# Altium schematic sheet 电机控制器原理图.SchDoc
size A3
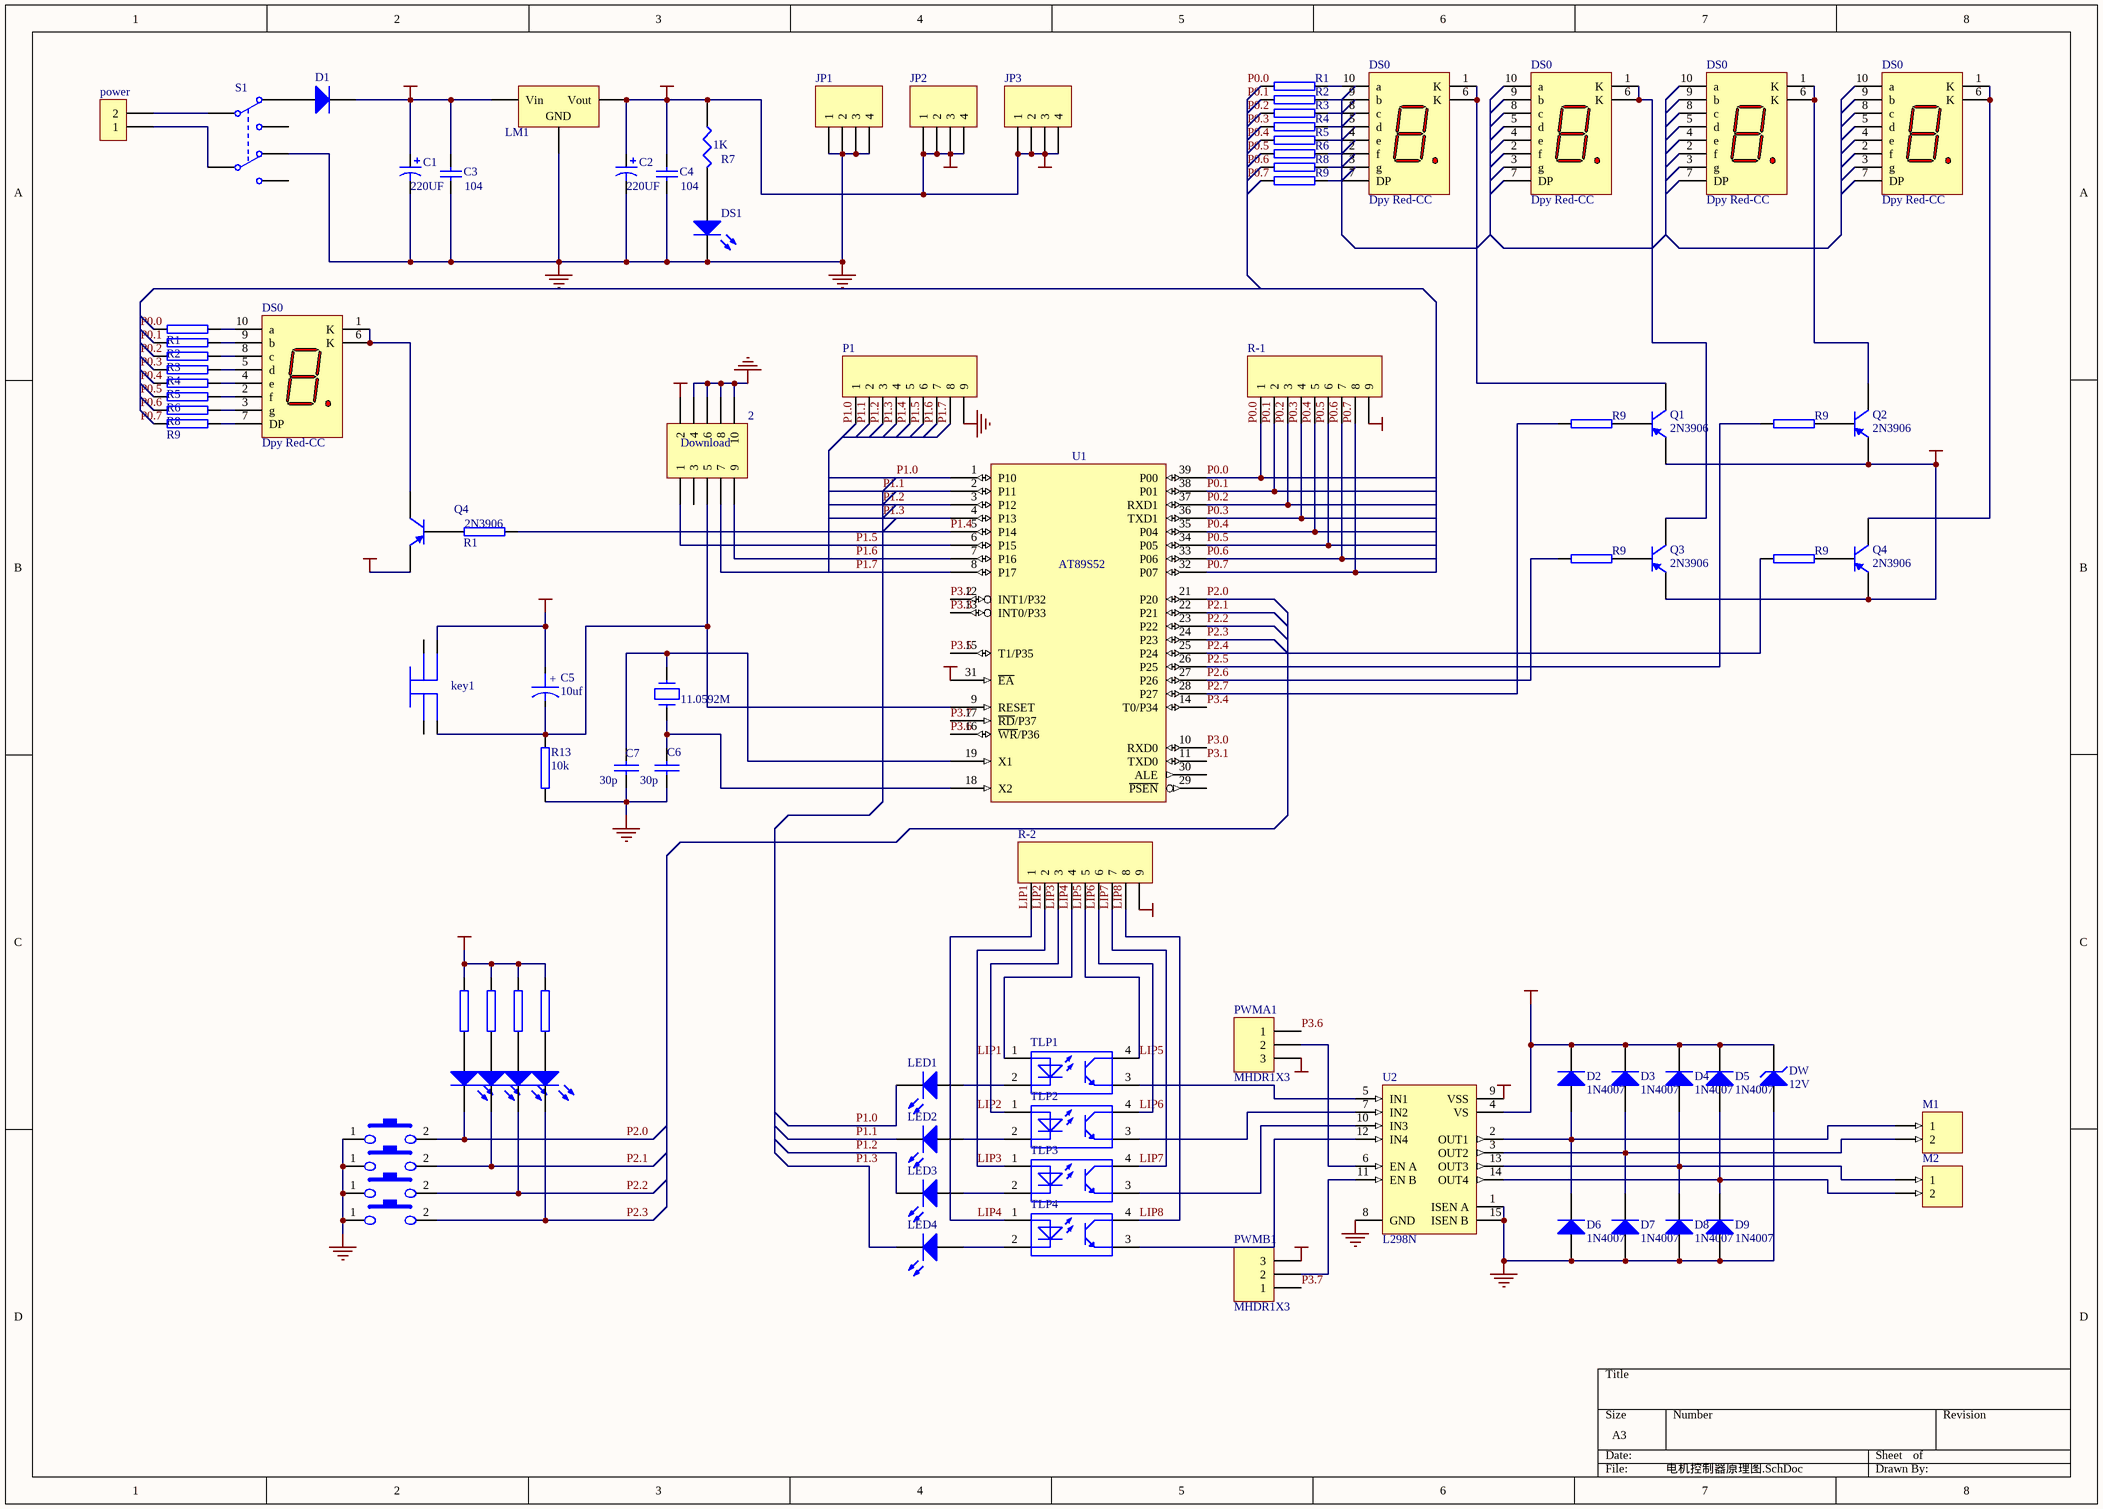
[diagram p0: 电机控制器原理图.SchDoc]

## Parts
(Parts that share a designator on the sheet are numbered #1, #2 ... from top to bottom, then left to right.)
1  power  [DZ-2]
2  Download  [HDR2X5]
3  key1  [AN66]  (value not drawn)
4  key2  [AN66]  (value not drawn)
5  key3  [AN66]  (value not drawn)
7  key4  [AN66]  (value not drawn)
C1  value 220UF  [CD6]
C2  value 220UF  [CD4]
C3  value 104  [HDR1X2]
C4  value 104  [HDR1X2]
C5  10uf  [CD5]
C6  30p  [C1608-0603]
C7  30p  [C1608-0603]
D1  (no value)  [DIO10.46-5.3x2.8]
D2  1N4007  [DIO7.8-4.6x2]
D3  1N4007  [DIO7.8-4.6x2]
D4  1N4007  [DIO7.8-4.6x2]
D5  1N4007  [DIO7.8-4.6x2]
D6  1N4007  [DIO7.8-4.6x2]
D7  1N4007  [DIO7.8-4.6x2]
D8  1N4007  [DIO7.8-4.6x2]
D9  1N4007  [DIO7.8-4.6x2]
DS0#1  Dpy Red-CC  [LEDDIP-10/C5.08RHD]
DS0#2  Dpy Red-CC  [LEDDIP-10/C5.08RHD]
DS0#3  Dpy Red-CC  [LEDDIP-10/C5.08RHD]
DS0#4  Dpy Red-CC  [LEDDIP-10/C5.08RHD]
DS0#5  Dpy Red-CC  [LEDDIP-10/C5.08RHD]
DS1  (no value)  [HDR1X2]
DW  12V  [DIODE-0.7]
JP1  (no value)  [HDR1X4]
JP2  (no value)  [HDR1X4]
JP3  (no value)  [HDR1X4]
key1  KEY  [AN66]  (value not drawn)
LED1  (no value)  [HDR1X2]
LED2  (no value)  [HDR1X2]
LED3  (no value)  [HDR1X2]
LED4  (no value)  [HDR1X2]
LED5  (no value)  [HDR1X2]
led6  (no value)  [HDR1X2]
LED7  (no value)  [HDR1X2]
LED8  (no value)  [HDR1X2]
LM1  (no value)  [wyk]
M1  (no value)  [DZ-2]
M2  (no value)  [DZ-2]
P1  (no value)  [HDR1X9]
PWMA1  MHDR1X3  [MHDR1X3]
PWMB1  MHDR1X3  [MHDR1X3]
Q1  2N3906  [BCY-W3/E4]
Q2  2N3906  [BCY-W3/E4]
Q3  2N3906  [BCY-W3/E4]
Q4#1  2N3906  [BCY-W3/E4]
Q4#2  2N3906  [BCY-W3/E4]
R1#1  470  [INDC2012-0805]  (value not drawn)
R1#2  470  [INDC2012-0805]  (value not drawn)
R1#3  470  [INDC2012-0805]  (value not drawn)
R2#1  470  [INDC2012-0805]  (value not drawn)
R2#2  470  [INDC2012-0805]  (value not drawn)
R3#1  470  [INDC2012-0805]  (value not drawn)
R3#2  470  [INDC2012-0805]  (value not drawn)
R4#1  470  [INDC2012-0805]  (value not drawn)
R4#2  470  [INDC2012-0805]  (value not drawn)
R5#1  470  [INDC2012-0805]  (value not drawn)
R5#2  470  [INDC2012-0805]  (value not drawn)
R6#1  470  [INDC2012-0805]  (value not drawn)
R6#2  470  [INDC2012-0805]  (value not drawn)
R7  1K  [HDR1X2]
R8#1  470  [INDC2012-0805]  (value not drawn)
R8#2  470  [INDC2012-0805]  (value not drawn)
R9#1  470  [INDC2012-0805]  (value not drawn)
R9#2  470  [INDC2012-0805]  (value not drawn)
R9#3  470  [INDC2012-0805]  (value not drawn)
R9#4  470  [INDC2012-0805]  (value not drawn)
R9#5  470  [INDC2012-0805]  (value not drawn)
R9#6  470  [INDC2012-0805]  (value not drawn)
R13  10k  [INDC2012-0805]
R15  470  [INDC2012-0805]  (value not drawn)
R16  470  [INDC2012-0805]  (value not drawn)
R17  470  [INDC2012-0805]  (value not drawn)
R18  470  [INDC2012-0805]  (value not drawn)
R-1  (no value)  [HDR1X9]
R-2  (no value)  [HDR1X9]
S1  (no value)  [DPDT-6]
TLP1  (no value)  [DIP4]
TLP2  (no value)  [DIP4]
TLP3  (no value)  [DIP4]
TLP4  (no value)  [DIP4]
U1  AT89S52  [DIP40]
U2  L298N  [DFM-T15/X1.6V]
Y1  11.0592M  [SPST-2]

## Nets
+12V: 2.2 C1.1 C2.1 C3.2 C4.2 C5.1 D1.2(K) D2.2(K) D3.2(K) D4.2(K) D5.2(K) DW.2(K) JP2.1 JP2.2 JP2.3 JP2.4 JP3.1 JP3.2 JP3.3 JP3.4 LM1.1(Vin) LM1.3(Vout) PWMA1.3 PWMB1.3 R7.1 R15.2 R16.2 R17.2 R18.2 R-1.9 R-2.9 U2.4(VS) U2.9(VSS)  [also labelled +5V]
GND: 2.4 2.6 2.8 2.10 3.1 4.1 5.1 7.1 C1.2 C2.2 C3.1 C4.1 C6.2 C7.2 D6.1(A) D7.1(A) D8.1(A) D9.1(A) DS1.2(K) DW.1(A) JP1.1 JP1.2 JP1.3 JP1.4 LM1.2(GND) P1.9 R13.2 S1.4(NC2) U1.20(GND) U2.1(ISEN_A) U2.8(GND) U2.15(ISEN_B)
VCC: Q1.1(E) Q2.1(E) Q3.1(E) Q4#1.1(E) Q4#2.1(E) U1.31(~{EA}) U1.40(VCC)
LIP1: R-2.1 R-2.2 R-2.3 R-2.4 TLP1.1 TLP2.1 TLP3.1 TLP4.1  [also labelled LIP2, LIP3, LIP4]
LIP5: R-2.5 TLP1.4
LIP6: R-2.6 TLP2.4
LIP7: R-2.7 TLP3.4
LIP8: R-2.8 TLP4.4
P0.0: R-1.1 U1.39(P00)
P0.1: R-1.2 U1.38(P01)
P0.2: R-1.3 U1.37(RXD1)
P0.3: R-1.4 U1.36(TXD1)
P0.4: R-1.5 U1.35(P04)
P0.5: R-1.6 U1.34(P05)
P0.6: R-1.7 U1.33(P06)
P0.7: R-1.8 U1.32(P07)
P1.0: LED1.2(K) P1.1 U1.1(P10)
P1.1: LED2.2(K) P1.2 U1.2(P11)
P1.2: LED3.2(K) P1.3 U1.3(P12)
P1.3: LED4.2(K) P1.4 U1.4(P13)
P1.4: P1.5 R1#3.1 U1.5(P14)
P1.5: 2.1 P1.6 U1.6(P15)
P1.6: 2.9 P1.7 U1.7(P16)
P1.7: 2.7 P1.8 U1.8(P17)
P2.0: 3.2 LED5.2(K) U1.21(P20)
P2.1: 4.2 led6.2(K) U1.22(P21)
P2.2: 5.2 LED7.2(K) U1.23(P22)
P2.3: 7.2 LED8.2(K) U1.24(P23)
P2.4: R9#6.1 U1.25(P24)
P2.5: R9#4.1 U1.26(P25)
P2.6: R9#5.1 U1.27(P26)
P2.7: R9#3.1 U1.28(P27)
P3.0: U1.10(RXD0)
P3.1: U1.11(TXD0)
P3.2: U1.12(INT1/P32)
P3.3: U1.13(INT0/P33)
P3.4: U1.14(T0/P34)
P3.5: U1.15(T1/P35)
P3.6: PWMA1.1 U1.16(~{WR}/P36)
P3.7: PWMB1.1 U1.17(~{RD}/P37)
Net1_1: 1.1 S1.5(COMMON2)
Net1_2: 1.2 S1.1(COMMON1)
Net2_5: 2.5 C5.2 R13.1 U1.9(RESET)
NetC6_1: C6.1 U1.18(X2) Y1.2
NetC7_1: C7.1 U1.19(X1) Y1.1
NetD1_1: D1.1(A) S1.2(NC1)
NetD2_1: D2.1(A) D6.2(K) M1.1 U2.2(OUT1)
NetD3_1: D3.1(A) D7.2(K) M1.2 U2.3(OUT2)
NetD4_1: D4.1(A) D8.2(K) M2.1 U2.13(OUT3)
NetD5_1: D5.1(A) D9.2(K) M2.2 U2.14(OUT4)
NetDS0#1_1: DS0#1.1(K) DS0#1.6(K) Q1.3(C)
NetDS0#1_2: DS0#1.2(f) R6#1.2
NetDS0#1_3: DS0#1.3(g) R8#1.2
NetDS0#1_4: DS0#1.4(e) R5#1.2
NetDS0#1_5: DS0#1.5(d) R4#1.2
NetDS0#1_7: DS0#1.7(DP) R9#1.2
NetDS0#1_8: DS0#1.8(c) R3#1.2
NetDS0#1_9: DS0#1.9(b) R2#1.2
NetDS0#1_10: DS0#1.10(a) R1#1.2
NetDS0#2_1: DS0#2.1(K) DS0#2.6(K) Q3.3(C)
NetDS0#3_1: DS0#3.1(K) DS0#3.6(K) Q2.3(C)
NetDS0#4_1: DS0#4.1(K) DS0#4.6(K) Q4#2.3(C)
NetDS0#5_1: DS0#5.1(K) DS0#5.6(K) Q4#1.3(C)
NetDS0#5_2: DS0#5.2(f) R6#2.2
NetDS0#5_3: DS0#5.3(g) R8#2.2
NetDS0#5_4: DS0#5.4(e) R5#2.2
NetDS0#5_5: DS0#5.5(d) R4#2.2
NetDS0#5_7: DS0#5.7(DP) R9#2.2
NetDS0#5_8: DS0#5.8(c) R3#2.2
NetDS0#5_9: DS0#5.9(b) R2#2.2
NetDS0#5_10: DS0#5.10(a) R1#2.2
NetDS1_1: DS1.1(A) R7.2
NetLED1_1: LED1.1(A) TLP1.2
NetLED2_1: LED2.1(A) TLP2.2
NetLED3_1: LED3.1(A) TLP3.2
NetLED4_1: LED4.1(A) TLP4.2
NetLED5_1: LED5.1(A) R17.1
Netled6_1: led6.1(A) R18.1
NetLED7_1: LED7.1(A) R15.1
NetLED8_1: LED8.1(A) R16.1
NetPWMA1_2: PWMA1.2 U2.6(EN_A)
NetPWMB1_2: PWMB1.2 U2.11(EN_B)
NetQ1_2: Q1.2(B) R9#3.2
NetQ2_2: Q2.2(B) R9#4.2
NetQ3_2: Q3.2(B) R9#5.2
NetQ4#1_2: Q4#1.2(B) R1#3.2
NetQ4#2_2: Q4#2.2(B) R9#6.2
NetTLP1_3: TLP1.3 U2.5(IN1)
NetTLP2_3: TLP2.3 U2.7(IN2)
NetTLP3_3: TLP3.3 U2.10(IN3)
NetTLP4_3: TLP4.3 U2.12(IN4)

Not connected (* = marked no-connect by the designer): 2 3; DS0#2 2(f) 3(g) 4(e) 5(d) 7(DP) 8(c) 9(b) 10(a); DS0#3 2(f) 3(g) 4(e) 5(d) 7(DP) 8(c) 9(b) 10(a); DS0#4 2(f) 3(g) 4(e) 5(d) 7(DP) 8(c) 9(b) 10(a); key1 0 1 2 3; R1#1 1; R1#2 1; R2#1 1; R2#2 1; R3#1 1; R3#2 1; R4#1 1; R4#2 1; R5#1 1; R5#2 1; R6#1 1; R6#2 1; R8#1 1; R8#2 1; R9#1 1; R9#2 1; S1 3(NO1) 6(NO2); U1 29(~{PSEN}) 30(ALE)

## Buses and harness runs
bus P0.0 = P0.1 = P0.2 = P0.3 = P0.4 = P0.5 = P0.6 = P0.7

## Notes on the sheet
- Labels drawn without touching a wire or pin: P0.0, P0.7
- (in symbol CAPACITOR POL) +

## Library data of the parts
2 = Header 5X2: Header, 5-Pin, Dual row; Revision: 17-Jul-2002: Re-released for DXP Platform.; Publisher: Altium Limited
3-5 7 = key
C1 C2 = Cap Pol1: Polarized Capacitor (Radial); Published: 8-Jun-2000; LatestRevisionDate: 17-Jul-2002; LatestRevisionNote: Re-released for DXP Platform.; Publisher: Altium Limited
C3 C4 = Cap: Capacitor; Published: 8-Jun-2000; LatestRevisionDate: 17-Jul-2002; LatestRevisionNote: Re-released for DXP Platform.; Publisher: Altium Limited
C5 = CAPACITOR POL: Capacitor
C6 C7 = CAP: Capacitor
D1-D9 = Diode 1N4007: 1 Amp General Purpose Rectifier; Published: 8-Jun-2000; LatestRevisionDate: 17-Jul-2002; LatestRevisionNote: Re-released for DXP Platform.; DatasheetDocument: 1998; PackageDocument: Aug-1999; PackageReference: DO-41; Publisher: Altium Limited; Code_JEDEC: DO-204-AL
DS0#1-DS0#5 = Dpy Red-CC: 7.62 mm Black Surface HER 7-Segment Display: CC, RH DP; MinimumIntensity: 360 ucd; Note: IF = 5 mA; Colour: High Efficiency Red (HER); Note: Pins 1 and 6 are redundant Cathodes.; Published: 8-Jun-2000; LatestRevisionDate: 17-Dec-2003; LatestRevisionNote: Schematic revised, PCB Footprint replaced.; DatasheetDocument: 19-Feb-2002; PackageDocument: 19-Feb-2002; PackageReference: A; Publisher: Altium Limited
DS1 = LED0: Typical INFRARED GaAs LED; Published: 8-Jun-2000; LatestRevisionDate: 17-Jul-2002; LatestRevisionNote: Re-released for DXP Platform.; Publisher: Altium Limited
DW = D Zener: Zener Diode; Published: 8-Jun-2000; LatestRevisionDate: 17-Jul-2002; LatestRevisionNote: Re-released for DXP Platform.; Publisher: Altium Limited
JP1-JP3 = Header 4: Header, 4-Pin; Revision: 17-Jul-2002: Re-released for DXP Platform.; Publisher: Altium Limited
LED1-LED5 led6 LED7 LED8 = LED3: Typical BLUE SiC LED; Published: 8-Jun-2000; LatestRevisionDate: 17-Dec-2003; LatestRevisionNote: PCB Footprint replaced.; Publisher: Altium Limited
LM1 = Volt Reg: Voltage Regulator; Published: 24-Mar-1999; LatestRevisionDate: 17-Jul-2002; LatestRevisionNote: Re-released for DXP Platform.; Publisher: Altium Limited; Code_JEDEC: SMD-220
M1 M2 = MHDR1X2: Header, 2-Pin; LatestRevisionDate: 17-Jul-2002; LatestRevisionNote: Re-released for DXP Platform.; Publisher: Altium Limited
P1 R-1 R-2 = Header 9: Header, 9-Pin; Revision: 17-Jul-2002: Re-released for DXP Platform.; Publisher: Altium Limited
PWMA1 PWMB1 = MHDR1X3: Header, 3-Pin; LatestRevisionDate: 17-Jul-2002; LatestRevisionNote: Re-released for DXP Platform.; Publisher: Altium Limited
Q1-Q3 Q4#1 Q4#2 = 2N3906: PNP General Purpose Amplifier; Published: 8-Jun-2000; LatestRevisionDate: 15-Jan-2003; LatestRevisionNote: PCB Footprint 'BCY-W3/D4.7' replaced; DatasheetDocument: 1997; PackageReference: TO-92A; Publisher: Altium Limited; Code_JEDEC: TO-92A
R1#1-R1#3 R2#1 R2#2 R3#1 R3#2 R4#1 R4#2 R5#1 R5#2 R6#1 R6#2 R8#1 R8#2 R9#1-R9#6 R13 R15-R18 = RES2
R7 = RES1
S1 = SW DPDT: Switch; Published: 24-Mar-1999; LatestRevisionDate: 17-Jul-2002; LatestRevisionNote: Re-released for DXP Platform.; Publisher: Altium Limited
TLP1-TLP4 = TLP521-1
U1 = 8051
U2 = L298N: Dual Full Bridge Driver; Published: 8-Jun-2000; LatestRevisionDate: 17-Jul-2002; LatestRevisionNote: Re-released for DXP Platform.; DatasheetDocument: Jul-1999; PackageDocument: Apr-1998; PackageReference: Multiwatt15H; Publisher: Altium Limited; ComponentLink1Description: Manufacturer Link; ComponentLink1URL: http://www.st.com/
Y1 = CRYSTAL